# EAGLE design usbFilter (EAGLE 8.2.1)
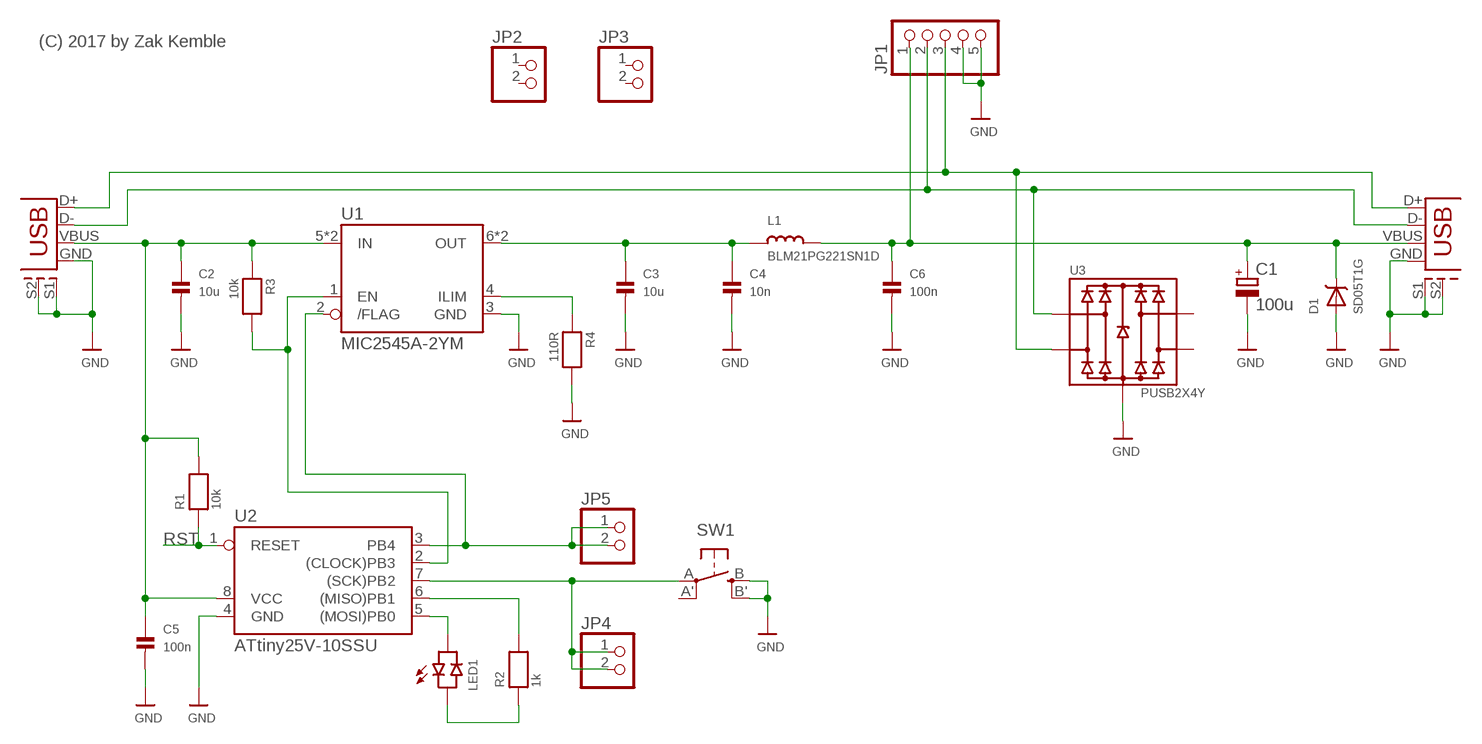
[diagram p0: schematic, sheet 1]

## Parts
C1  100u  CPOL-EUE2.5-6  [E2,5-6]
C2  10u  CAP_CERAMIC0805  [0805_NO_OUTLINE]
C3  10u  CAP_CERAMIC0805  [0805_NO_OUTLINE]
C4  10n  CAP_CERAMIC0402  [0402]
C5  100n  CAP_CERAMIC0402  [0402]
C6  100n  CAP_CERAMIC0402  [0402]
D1  SD05T1G  DIODE-ZENERSOD-323  [SOD-323]
JP1  PINHD-1X5  [1X05]
JP2  PINHD-1X2  [1X02]
JP3  PINHD-1X2  [1X02]
JP4  PINHD-1X2  [1X02]
JP5  PINHD-1X2  [1X02]
L1  BLM21PG221SN1D  INDUCTOR0805  [0805_NO_OUTLINE]
LED1  LEDBI0805  [CHIPLED_0805_NOOUTLINE]
R1  10k  RESISTOR0402  [0402]
R2  1k  RESISTOR0402  [0402]
R3  10k  RESISTOR0402  [0402]
R4  110R  RESISTOR0805_NO_OUTLINE  [0805_NO_OUTLINE]
SW1  SPST_TACTMC32882  [TACT_SMD4]
U1  MIC2545A-2YM  NCP380MIC2545  [SOIC8_150MIL_SMPAD]
U2  ATtiny25V-10SSU  ATTINY85150MIL_SMPAD  [SOIC8_150MIL_SMPAD]
U3  PUSB2X4Y  [SOT-363]
USB1  USB-TYPE-B  [USB-TYPE-B]
USB2  USB-TYPE-A-VERT  [USB-TYPE-A-VERT]

## Nets
GND: C1.- C2.2 C3.2 C4.2 C5.2 C6.2 D1.A JP1.4 JP1.5 R4.2 SW1.B'(S1) SW1.B(S) U1.3(GND) U2.4(GND) U3.2(GND) USB1.GND USB1.S1(SHEILD1) USB1.S2(SHEILD2) USB2.GND USB2.S1(SHEILD1) USB2.S2(SHEILD2)
N$1: C2.1 C5.1 R1.2 R3.1 U1.5(IN) U1.7(IN) U2.8(VCC) USB1.VBUS
N$2: JP1.2 U3.1(IO1) USB1.D- USB2.D-
N$3: C3.1 C4.1 L1.1 U1.6(OUT) U1.8(OUT)
N$5: JP1.3 U3.3(IO2) USB1.D+ USB2.D+
N$6: C1.+ C6.1 D1.C JP1.1 L1.2 USB2.VBUS
N$8: R3.2 U1.1(EN) U2.2((CLOCK)PB3)
N$10: JP5.1 JP5.2 U1.2(/FLAG) U2.3(PB4)
N$11: R4.1 U1.4(ILIM)
N$12: LED1.C R2.1
N$13: R2.2 U2.6((MISO)PB1)
N$14: LED1.A U2.5((MOSI)PB0)
N$15: JP4.1 JP4.2 SW1.A(P) U2.7((SCK)PB2)
RST: R1.1 U2.1(RESET)
Unconnected: JP2.1 JP2.2 JP3.1 JP3.2 SW1.A'(P1) U3.4(IO3) U3.6(IO4)

## Notes on the sheet
- (C) 2017 by Zak Kemble

## Library data of the parts
C1 = resistor:CPOL-EU: POLARIZED CAPACITOR, European symbol
C2-C6 = zak:CAP_CERAMIC
D1 = zak:DIODE-ZENER
JP1 = pinhead:PINHD-1X5: PIN HEADER
JP2-JP5 = pinhead:PINHD-1X2: PIN HEADER
L1 = zak:INDUCTOR
LED1 = zak:LEDBI
R1-R4 = zak:RESISTOR
SW1 = zak:SPST_TACT
U1 = zak:NCP380
U2 = zak:ATTINY85
U3 = zak:PUSB2X4Y
USB1 = zak:USB-TYPE-B
USB2 = zak:USB-TYPE-A-VERT

## Board
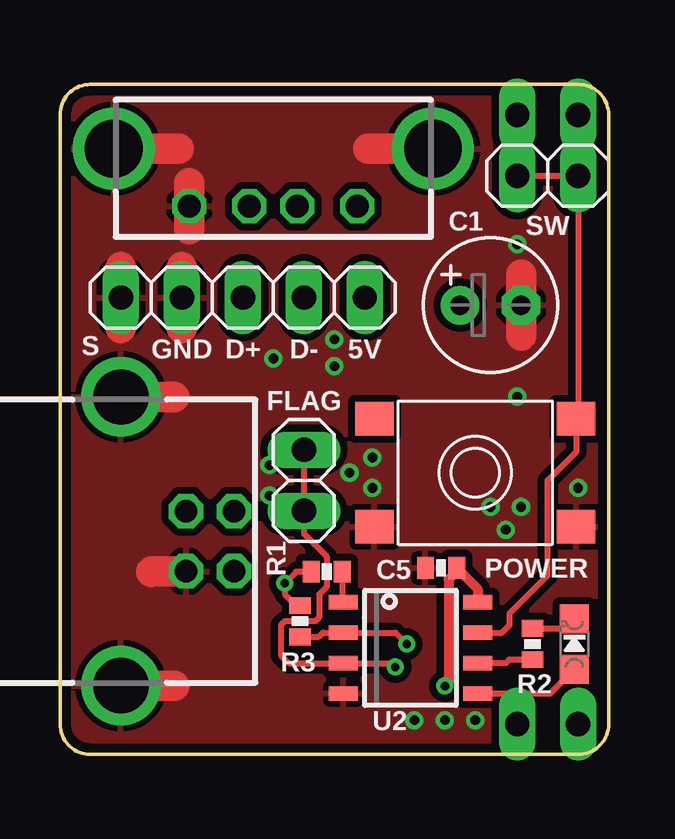
[diagram p1: board, top side]
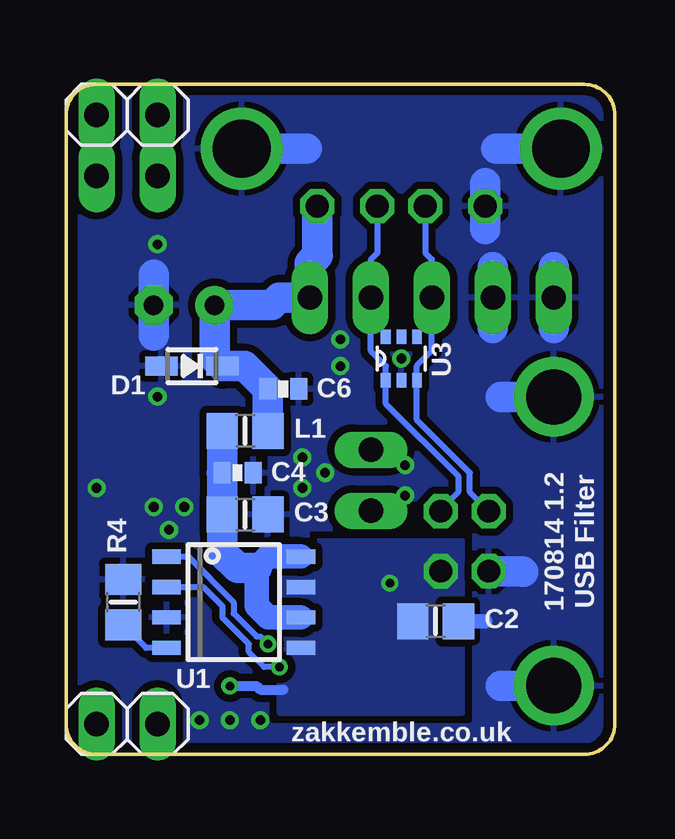
[diagram p2: board, bottom side, seen from below]

Size 22.86 x 27.94 mm. Coordinates in mm from the lower left corner, seen from the top.
Outline: 21.59,27.94 arc-90 22.86,26.67 22.86,1.27 arc-90 21.59,0 1.27,0 arc-90 0,1.27 0,26.67 arc-90 1.27,27.94 21.59,27.94
Copper layers (1*16): Top 0.0356mm / dielectric 1.5011mm / Bottom 0.0356mm
Design rules "oshpark-2layer-zakcustom": minimum track width 6mil, minimum drill 13mil, track to track 6mil, track to pad 6mil, pad to pad 6mil, via to via 6mil, smd to smd 6mil, copper to edge 15mil, drill to drill 6mil, minimum pad ring 7mil, minimum via ring 7mil, stop-mask expansion 2.5mil, vias tented up to drill 24mil, thermal gap 10mil
bRestrict: area 8.6,14.8 to 9.2,15.1

### Footprints (pad centres in the part's own frame; a part is rotated, then mirrored left to right if it is on the bottom)
E2,5-6 = drill 0.813 pad 1.6: + -1.27,0 | drill 0.813 pad 1.6 octagon: - 1.27,0
0805_NO_OUTLINE = smd 1.3 x 1.5: 1 -0.95,0; 2 0.95,0
0402 = smd 0.7 x 0.9: 1 -0.65,0; 2 0.65,0
SOD-323 = smd 1.35 x 0.8: A 1.27,0; C -1.27,0
1X05 = drill 1.016 long: 1 -5.08,0; 2 -2.54,0; 3 0,0; 4 2.54,0; 5 5.08,0
1X02 = drill 1.016 long: 1 -1.27,0; 2 1.27,0
CHIPLED_0805_NOOUTLINE = smd 1.2 x 1.2: A 0,-1.05; C 0,1.05
TACT_SMD4 = smd 1.6 x 1.4: A -4.2,-2.25; A' 4.2,-2.25; B -4.2,2.25; B' 4.2,2.25
SOIC8_150MIL_SMPAD = smd 0.6 x 1.2: 1 -1.905,-2.8; 2 -0.635,-2.8; 3 0.635,-2.8; 4 1.905,-2.8; 5 1.905,2.8; 6 0.635,2.8; 7 -0.635,2.8; 8 -1.905,2.8
SOT-363 = smd 0.6 x 0.4: 1 -0.9,0.65; 2 -0.9,0; 3 -0.9,-0.65; 4 0.9,-0.65; 5 0.9,0; 6 0.9,0.65
USB-TYPE-B = drill 0.95 octagon: D+ -1.25,2.71; D- -1.25,4.71; GND 1.25,2.71; VBUS 1.25,4.71 | drill 2.3 pad 2.9: S1 -6.02,0; S2 6.02,0
USB-TYPE-A-VERT = drill 0.95 octagon: D+ 1,0; D- -1,0; GND 3.5,0; VBUS -3.5,0 | drill 2.4 pad 3: S1 -6.65,-2.4; S2 6.65,-2.4

### Placement (x,y rotation side)
C1  17.94,18.73 0 top
C2  7.46,5.56 0 bottom
C3  15.4,10 0 bottom
C4  15.72,11.75 0 bottom
C5  15.88,7.78 180 top
C6  13.81,15.24 0 bottom
D1  17.62,16.19 180 bottom
JP1  7.62,19.05 180 top
JP2  20.32,26.67 0 bottom
JP3  20.32,1.27 0 bottom
JP4  20.32,24.13 180 top
JP5  10.16,11.43 90 top
L1  15.4,13.49 0 bottom
LED1  21.43,4.6 0 top
R1  11.11,7.62 180 top
R2  19.68,4.6 270 top
R3  10,5.56 270 top
R4  20.48,6.35 90 bottom
SW1  17.3,11.75 180 top
U1  15.88,6.35 270 bottom
U2  14.61,4.45 270 top
U3  8.89,16.51 90 bottom
USB1  2.54,8.89 270 top
USB2  8.89,22.86 180 top

### Tracks (layer width: path | path; a pad name or v marks a point on that pad's centre or on a via)
GND  (via drill 0.4)
  Top 1.27: USB1.S2 4.75,2.87 | USB1.S1 4.75,14.91 | USB2.S2 4.94,25.26 | USB2.S1 12.84,25.26 | 19.21,20 C1.- 19.21,17.46 | USB1.GND 3.83,7.64 3.81,7.62 | 5.39,23.82 USB2.GND 5.39,21.9 | 5.08,20.32 JP1.4 5.08,17.78 | 2.54,20.32 JP1.5 2.54,17.78
  Bottom 0.61: C2.2 5.4,5.56
  Bottom 1.27: USB2.S2 4.94,25.26 | USB2.S1 12.84,25.26 | USB1.S2 4.75,2.87 | USB1.S1 4.75,14.91 | 19.21,20 C1.- 19.21,17.46 | USB1.GND 3.83,7.64 3.81,7.62 | 5.39,23.82 USB2.GND 5.39,21.9 | 2.54,20.32 JP1.5 2.54,17.78 | 5.08,20.32 JP1.4 5.08,17.78
  other vias: 8.89,16.51 19.05,14.92 19.05,21.27 19.21,10.32 11.43,16.19 11.43,17.3 13.02,11.11 13.02,12.38 12.06,11.75 21.59,11.11 17.3,1.43 16.03,1.43 14.76,1.43 17.94,10.32 18.57,9.37 8.73,10.79 8.73,12.06
  pour Bottom (isolate 0.305, rank 6): 0,27.94 22.86,27.94 22.86,0 0,0
  pour Top (isolate 0.305, rank 6): 0,27.94 22.86,27.94 22.86,0 0,0
N$1  (via drill 0.35)
  Top 0.254: R3.1 9.83,6.21 9.37,6.67 v9.37,7.14 9.84,7.62 R1.2
  Top 0.406: U2.8 17.41,6.9 C5.1 16.52,7.63 16.19,7.3 16.19,3.02 v16.03,2.86
  Bottom 0.406: v16.03,2.86 14.92,2.86 14.76,2.7 13.81,2.7
  pour Bottom (isolate 0.305, rank 5, no thermals): 6.35,8.89 13.97,8.89 13.97,1.75 6.35,1.75
N$2
  Bottom 0.254: USB1.D- 7.25,10.21 6.51,10.95 6.51,11.59 9.54,14.62 U3.1 9.54,16.21 10.16,16.83 JP1.2 10.16,20.64 9.89,20.91 USB2.D-
N$3
  Bottom 1.016: U1.6 14.45,5.71 14.92,6.19 14.92,7.78 14.45,8.26 U1.8
  Bottom 1.27: 14.92,7.78 15.72,7.78 16.35,8.41 C3.1 16.35,11.73 C4.1 16.35,11.77 L1.1
N$5
  Bottom 0.254: USB1.D+ 5.25,10.17 6.03,10.95 6.03,11.75 8.24,13.96 U3.3 8.24,16.21 7.62,16.83 JP1.3 7.62,20.64 7.89,20.91 USB2.D+
N$6
  Bottom 1.27: L1.2 14.45,15.23 C6.1 15.41,16.19 D1.C 16.67,16.51 C1.+ 14.29,18.73 13.97,19.05 JP1.1 12.7,20.48 | 12.7,20.48 12.38,20.8 | USB2.VBUS 12.39,20.79 12.7,20.48
N$8  (via drill 0.35)
  Top 0.254: 10,4.92 R3.2 10.78,4.91 10.95,5.08 U2.2 13.97,5.08 v14.45,4.6
  Bottom 0.254: U1.1 17.78,8.26 15.88,6.35 15.88,5.87 14.92,4.92 14.76,4.92 v14.45,4.6
N$10  (via drill 0.35)
  Top 0.254: v13.97,3.65 13.81,3.81 U2.3 9.53,3.81 9.21,4.13 9.21,5.4 9.37,5.56 10.64,5.56 10.79,5.71 10.79,6.67 11.11,6.99 11.11,8.26 10.16,9.21 JP5.1 JP5.2
  Bottom 0.254: U1.2 17.14,6.99 16.35,6.19 16.35,5.71 15.24,4.6 15.24,4.29 14.61,3.65 v13.97,3.65
N$11
  Bottom 0.254: U1.4 19.52,4.45 R4.1
N$12
  Top 0.254: R2.1 21.03,5.25 LED1.C
N$13
  Top 0.254: U2.6 18.57,3.81 18.72,3.95 R2.2
N$14
  Top 0.254: U2.5 20.42,2.54 LED1.A
N$15
  Top 0.254: JP4.2 JP4.1 21.59,14.08 SW1.A 21.5,12.61 20.32,11.43 20.32,7.46 18.73,5.87 18.73,5.4 18.41,5.08 U2.7
RST
  Top 0.254: R1.1 11.76,6.39 U2.1

### Text on the board
tPlace: SW | S | GND | D+ | D- | 5V | FLAG | POWER
bPlace: USB Filter | 170814 1.2 | zakkemble.co.uk